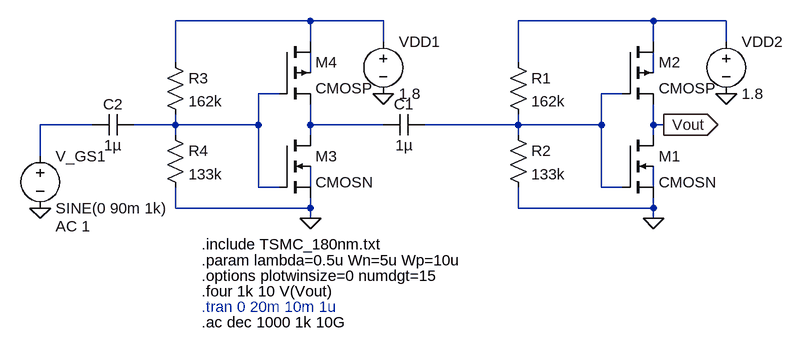
[diagram p0: schematic 4_cascade.asc]
4_cascade.asc, the LTspice schematic file:
Version 4
SHEET 1 1740 680
WIRE 1008 -112 800 -112
WIRE 1120 -112 1008 -112
WIRE 1536 -112 1328 -112
WIRE 1648 -112 1536 -112
WIRE 1008 -80 1008 -112
WIRE 1120 -80 1120 -112
WIRE 1536 -80 1536 -112
WIRE 1648 -80 1648 -112
WIRE 800 -48 800 -112
WIRE 1328 -48 1328 -112
WIRE 1008 -32 1008 -64
WIRE 1536 -32 1536 -64
WIRE 960 0 928 0
WIRE 1488 0 1456 0
WIRE 672 48 592 48
WIRE 800 48 800 32
WIRE 800 48 736 48
WIRE 928 48 928 0
WIRE 928 48 800 48
WIRE 1008 48 1008 16
WIRE 1120 48 1008 48
WIRE 1328 48 1328 32
WIRE 1328 48 1184 48
WIRE 1456 48 1456 0
WIRE 1456 48 1328 48
WIRE 1536 48 1536 16
WIRE 1552 48 1536 48
WIRE 800 64 800 48
WIRE 1008 64 1008 48
WIRE 1328 64 1328 48
WIRE 1536 64 1536 48
WIRE 592 96 592 48
WIRE 928 144 928 48
WIRE 960 144 928 144
WIRE 1008 144 1008 112
WIRE 1456 144 1456 48
WIRE 1488 144 1456 144
WIRE 1536 144 1536 112
WIRE 800 176 800 144
WIRE 1008 176 1008 160
WIRE 1008 176 800 176
WIRE 1328 176 1328 144
WIRE 1536 176 1536 160
WIRE 1536 176 1328 176
WIRE 1008 192 1008 176
WIRE 1536 192 1536 176
FLAG 1008 192 0
FLAG 1120 0 0
FLAG 592 176 0
FLAG 1536 192 0
FLAG 1648 0 0
FLAG 1552 48 Vout
IOPIN 1552 48 Out
SYMBOL nmos4 960 64 R0
SYMATTR InstName M3
SYMATTR Value CMOSN
SYMATTR Value2 l={2*lambda} w={Wn} ad={5*lambda*Wn} as={5*lambda*Wn} pd={2*Wn + 10*lambda} ps={2*Wn + 10*lambda}
SYMBOL pmos4 960 -80 R0
SYMATTR InstName M4
SYMATTR Value CMOSP
SYMATTR Value2 l={2*lambda} w={Wp} ad={5*lambda*Wp} as={5*lambda*Wp} pd={2*Wp + 10*lambda} ps={2*Wp + 10*lambda}
SYMBOL voltage 1120 -96 R0
WINDOW 123 0 0 Left 0
WINDOW 39 0 0 Left 0
SYMATTR InstName VDD1
SYMATTR Value 1.8
SYMBOL res 784 -64 R0
SYMATTR InstName R3
SYMATTR Value 162k
SYMBOL res 784 48 R0
SYMATTR InstName R4
SYMATTR Value 133k
SYMBOL cap 736 32 R90
WINDOW 0 0 32 VBottom 2
WINDOW 3 32 32 VTop 2
SYMATTR InstName C2
SYMATTR Value 1µ
SYMBOL voltage 592 80 R0
WINDOW 123 24 124 Left 2
WINDOW 39 0 0 Left 0
SYMATTR Value2 AC 1
SYMATTR InstName V_GS1
SYMATTR Value SINE(0 90m 1k)
SYMBOL nmos4 1488 64 R0
SYMATTR InstName M1
SYMATTR Value CMOSN
SYMATTR Value2 l={2*lambda} w={Wn} ad={5*lambda*Wn} as={5*lambda*Wn} pd={2*Wn + 10*lambda} ps={2*Wn + 10*lambda}
SYMBOL pmos4 1488 -80 R0
SYMATTR InstName M2
SYMATTR Value CMOSP
SYMATTR Value2 l={2*lambda} w={Wp} ad={5*lambda*Wp} as={5*lambda*Wp} pd={2*Wp + 10*lambda} ps={2*Wp + 10*lambda}
SYMBOL voltage 1648 -96 R0
WINDOW 123 0 0 Left 0
WINDOW 39 0 0 Left 0
SYMATTR InstName VDD2
SYMATTR Value 1.8
SYMBOL res 1312 -64 R0
SYMATTR InstName R1
SYMATTR Value 162k
SYMBOL res 1312 48 R0
SYMATTR InstName R2
SYMATTR Value 133k
SYMBOL cap 1184 32 R90
WINDOW 0 0 32 VBottom 2
WINDOW 3 32 32 VTop 2
SYMATTR InstName C1
SYMATTR Value 1µ
TEXT 840 232 Left 2 !.include TSMC_180nm.txt
TEXT 840 256 Left 2 !.param lambda=0.5u Wn=5u Wp=10u
TEXT 840 328 Left 2 ;.tran 0 20m 10m 1u
TEXT 840 304 Left 2 !.four 1k 10 V(Vout)
TEXT 840 280 Left 2 !.options plotwinsize=0 numdgt=15
TEXT 840 352 Left 2 !.ac dec 1000 1k 10G

The netlist it stands for:
* 4_cascade.asc
M3 N008 N005 0 N009 CMOSN l={2*lambda} w={Wn} ad={5*lambda*Wn} as={5*lambda*Wn} pd={2*Wn + 10*lambda} ps={2*Wn + 10*lambda}
M4 N001 N005 N008 N003 CMOSP l={2*lambda} w={Wp} ad={5*lambda*Wp} as={5*lambda*Wp} pd={2*Wp + 10*lambda} ps={2*Wp + 10*lambda}
VDD1 N001 0 1.8
R3 N001 N005 162k
R4 N005 0 133k
C2 N005 N007 1µ
V_GS1 N007 0 SINE(0 90m 1k) AC 1
M1 Vout N006 0 N010 CMOSN l={2*lambda} w={Wn} ad={5*lambda*Wn} as={5*lambda*Wn} pd={2*Wn + 10*lambda} ps={2*Wn + 10*lambda}
M2 N002 N006 Vout N004 CMOSP l={2*lambda} w={Wp} ad={5*lambda*Wp} as={5*lambda*Wp} pd={2*Wp + 10*lambda} ps={2*Wp + 10*lambda}
VDD2 N002 0 1.8
R1 N002 N006 162k
R2 N006 0 133k
C1 N006 N008 1µ
.model NMOS NMOS
.model PMOS PMOS
.lib standard.mos
.include TSMC_180nm.txt
.param lambda=0.5u Wn=5u Wp=10u
* .tran 0 20m 10m 1u
.four 1k 10 V(Vout)
.options plotwinsize=0 numdgt=15
.ac dec 1000 1k 10G
.backanno
.end